# EAGLE design usb_board (EAGLE 9.6.2)
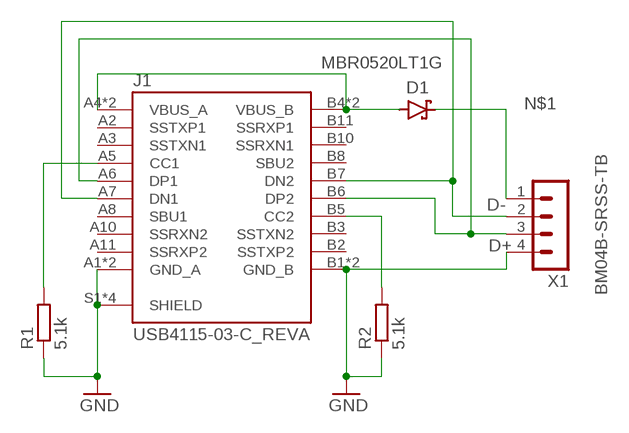
[diagram p0: schematic, sheet 1]

## Parts
D1  MBR0520LT1G  SCHOTTKY_MBR0520LT1GDO-219  [SODFL3718X115]
J1  USB4115-03-C_REVA  [GCT_USB4115-03-C_REVA]
R1  5.1k  R-EU_R0805  [R0805]
R2  5.1k  R-EU_R0805  [R0805]
X1  BM04B-SRSS-TB  [BM04B-SRSS-TB]

## Nets
D+: J1.A6(DP1) J1.B6(DP2) X1.3
D-: J1.A7(DN1) J1.B7(DN2) X1.2
GND: J1.A1(GND_A) J1.A12(GND_A) J1.B1(GND_B) J1.B12(GND_B) J1.S1(SHIELD) J1.S2(SHIELD) J1.S3(SHIELD) J1.S4(SHIELD) R1.1 R2.1 X1.4
N$1: D1.1(C) X1.1
N$2: J1.A5(CC1) R1.2
N$4: J1.B5(CC2) R2.2
VCC: D1.2(A) J1.A4(VBUS_A) J1.A9(VBUS_A) J1.B4(VBUS_B) J1.B9(VBUS_B)
Unconnected: J1.A2(SSTXP1) J1.A3(SSTXN1) J1.A8(SBU1) J1.A10(SSRXN2) J1.A11(SSRXP2) J1.B2(SSTXP2) J1.B3(SSTXN2) J1.B8(SBU2) J1.B10(SSRXN1) J1.B11(SSRXP1)

## Library data of the parts
D1 = Diode:SCHOTTKY_: Schottky Diode - Popular parts; BUY: https://www.digikey.co.uk/en/products/detail/comchip-technology/CDBW140-G/3308555; CATEGORY: Diode; DESCRIPTION: DIODE SCHOTTKY 20V 500MA SOD123; MANUFACTURER: ON Semiconductor; MPN: MBR0520LT1G; SUB-CATEGORY: Schottky
J1 = USB4115-03-C_REVA:USB4115-03-C_REVA: Check prices <https://pricing.snapeda.com/parts/USB4115-03-C/Global%20Connector%20Technology/view-part?ref=eda>; AVAILABILITY: In Stock; DESCRIPTION: USB 3.1 Connector Type C Vertical Receptacle, 9.25mm profile, 24 Pins, Surface mount, Top mount, low cost; MF: Global Connector Technology; MP: USB4115-03-C; PACKAGE: None; PRICE: None
R1 R2 = rcl:R-EU_: RESISTOR, European symbol; SPICEPREFIX: R
X1 = con-JST SH:BM04B-SRSS: JST SH series header 1.00mm pitch disconnectable crimp style connectors, vertical (side entry type), 4 pins

## Board
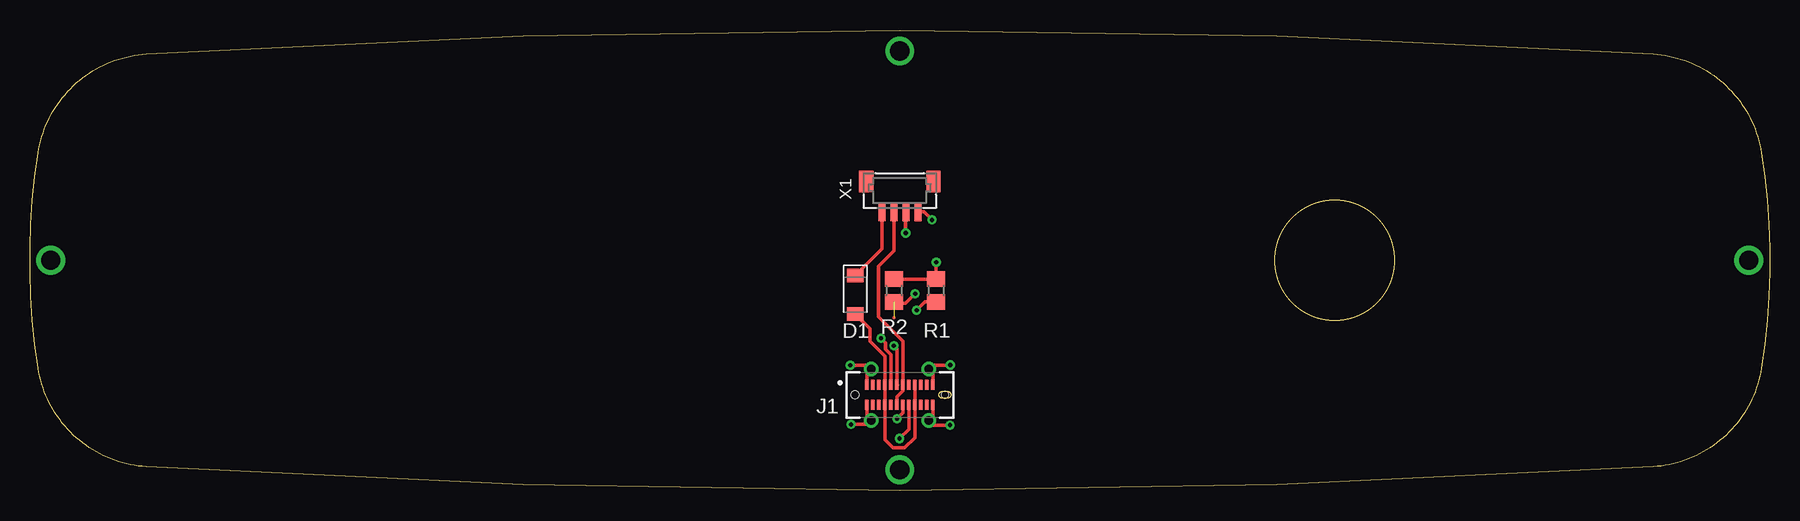
[diagram p1: board, top side]
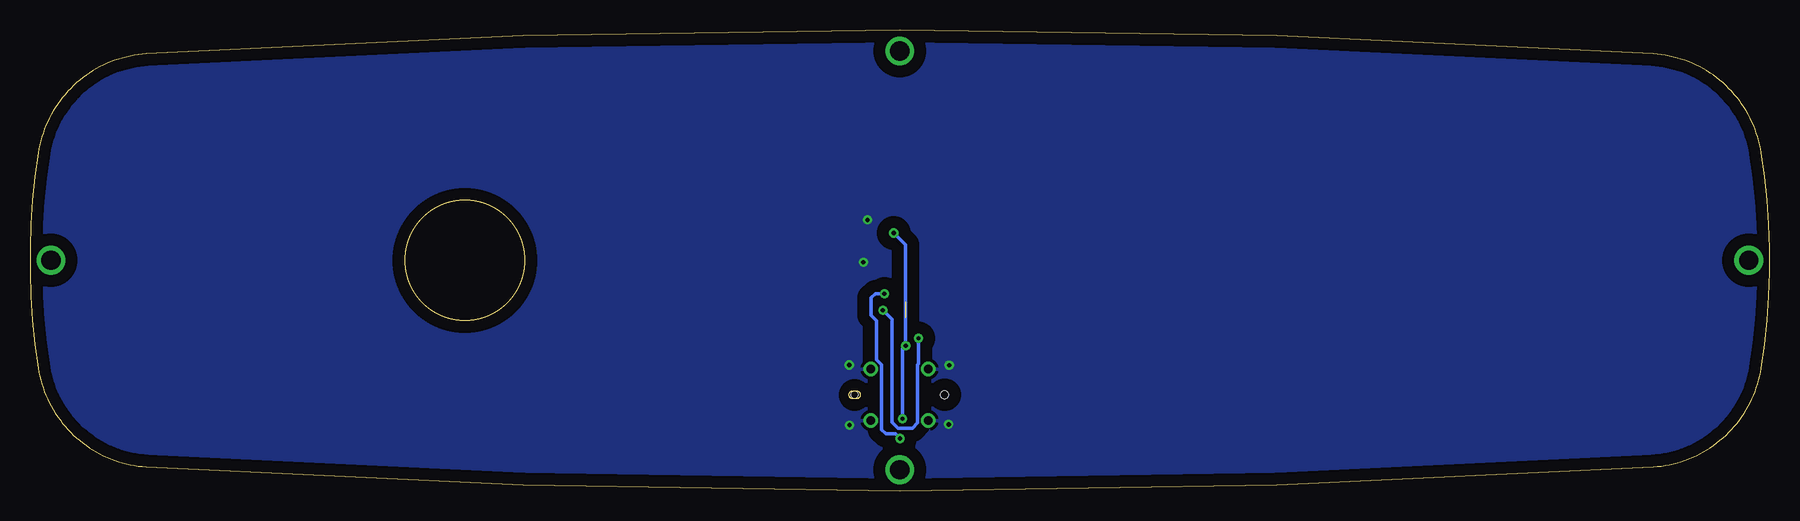
[diagram p2: board, bottom side, seen from below]

Size 145 x 38.4 mm. Coordinates in mm from the lower left corner, seen from the top.
Outline: 135.3,36.4 135.64,36.37 135.97,36.34 136.31,36.28 136.64,36.22 136.97,36.15 137.3,36.06 137.62,35.97 137.94,35.86 138.26,35.74 138.57,35.61 138.88,35.47 139.18,35.32 139.48,35.16 139.77,34.99 140.06,34.81 140.33,34.62 140.61,34.41 140.87,34.2 141.13,33.99 141.38,33.76 141.62,33.52 141.85,33.28 142.08,33.02 142.29,32.76 142.5,32.5 142.7,32.22 142.89,31.94 143.06,31.65 143.23,31.36 143.39,31.06 143.53,30.75 143.67,30.45 143.8,30.13 143.91,29.81 144.01,29.49 144.11,29.17 144.19,28.84 144.26,28.51 144.31,28.17 144.59,26.19 144.8,24.2 144.93,22.2 145,20.2 145,18.2 144.93,16.2 144.8,14.2 144.59,12.21 144.31,10.23 144.26,9.89 144.19,9.56 144.11,9.23 144.01,8.91 143.91,8.59 143.8,8.27 143.67,7.95 143.53,7.64 143.39,7.34 143.23,7.04 143.06,6.75 142.89,6.46 142.7,6.18 142.5,5.9 142.29,5.64 142.08,5.38 141.85,5.12 141.62,4.88 141.38,4.64 141.13,4.41 140.87,4.19 140.61,3.98 140.33,3.78 140.06,3.59 139.77,3.41 139.48,3.24 139.18,3.08 138.88,2.93 138.57,2.79 138.26,2.66 137.94,2.54 137.62,2.43 137.3,2.34 136.97,2.25 136.64,2.18 136.31,2.11 135.97,2.06 135.64,2.02 135.3,2 103.92,0.5 72.5,0 41.08,0.5 9.7,2 9.36,2.02 9.03,2.06 8.69,2.11 8.36,2.18 8.03,2.25 7.7,2.34 7.38,2.43 7.06,2.54 6.74,2.66 6.43,2.79 6.12,2.93 5.82,3.08 5.52,3.24 5.23,3.41 4.95,3.59 4.67,3.78 4.4,3.98 4.13,4.19 3.87,4.41 3.62,4.64 3.38,4.88 3.15,5.12 2.92,5.38 2.71,5.64 2.5,5.9 2.3,6.18 2.12,6.46 1.94,6.75 1.77,7.04 1.61,7.34 1.47,7.64 1.33,7.95 1.2,8.27 1.09,8.59 0.99,8.91 0.89,9.23 0.81,9.56 0.74,9.89 0.69,10.23 0.41,12.21 0.21,14.2 0.07,16.2 0,18.2 0,20.2 0.07,22.2 0.21,24.2 0.41,26.19 0.69,28.17 0.74,28.51 0.81,28.84 0.89,29.17 0.99,29.49 1.09,29.81 1.2,30.13 1.33,30.45 1.47,30.75 1.61,31.06 1.77,31.36 1.94,31.65 2.12,31.94 2.3,32.22 2.5,32.5 2.71,32.76 2.92,33.02 3.15,33.28 3.38,33.52 3.62,33.76 3.87,33.99 4.13,34.2 4.4,34.41 4.67,34.62 4.95,34.81 5.23,34.99 5.52,35.16 5.82,35.32 6.12,35.47 6.43,35.61 6.74,35.74 7.06,35.86 7.38,35.97 7.7,36.06 8.03,36.15 8.36,36.22 8.69,36.28 9.03,36.34 9.36,36.37 9.7,36.4 41.08,37.9 72.5,38.4 103.92,37.9 135.3,36.4
Outline: circle at 108.76,19.2 radius 5
Copper layers (1*16): Top 0.035mm / dielectric 1.5mm / Bottom 0.035mm
Design rules "default *": minimum track width 12mil, minimum drill 0.35mm, track to track 6mil, track to pad 6mil, pad to pad 6mil, via to via 6mil, smd to smd 6mil, copper to edge 40mil, drill to drill 6mil, minimum pad ring 10mil, minimum via ring 8mil, stop-mask expansion 4mil, vias tented up to drill 0mil, thermal gap 10mil

### Footprints (pad centres in the part's own frame; a part is rotated, then mirrored left to right if it is on the bottom)
SODFL3718X115 = smd 1.115 x 1.361: 1 -1.6,0; 2 1.6,0
GCT_USB4115-03-C_REVA = smd 0.3 x 0.85: A1 -2.75,0.835; A2 -2.25,0.835; A3 -1.75,0.835; A4 -1.25,0.835; A5 -0.75,0.835; A6 -0.25,0.835; A7 0.25,0.835; A8 0.75,0.835; A9 1.25,0.835; A10 1.75,0.835; A11 2.25,0.835; A12 2.75,0.835; B1 2.75,-0.835; B2 2.25,-0.835; B3 1.75,-0.835; B4 1.25,-0.835; B5 0.75,-0.835; B6 0.25,-0.835; B7 -0.25,-0.835; B8 -0.75,-0.835; B9 -1.25,-0.835; B10 -1.75,-0.835; B11 -2.25,-0.835; B12 -2.75,-0.835 | drill 0.7 pad 1.1: S1 -2.4,2.15; S2 -2.4,-2.15; S3 2.4,-2.15; S4 2.4,2.15 | hole 0.66: -3.75,0 | hole 0.58: 3.75,0
R0805 = smd 1.3 x 1.5: 1 -0.95,0; 2 0.95,0
BM04B-SRSS-TB = smd 0.6 x 1.55: 1 1.5,0; 2 0.5,0; 3 -0.5,0; 4 -1.5,0 | smd 1.2 x 1.8: M1 2.8,-2.525; M2 -2.8,-2.525

### Placement (x,y rotation side)
D1  68.79,16.33 270 top
J1  72.51,8 0 top
R1  75.52,16.69 270 top
R2  72.02,16.69 270 top
X1  72.51,23.24 180 top

### Tracks (layer width: path | path; a pad name or v marks a point on that pad's centre or on a via)
AGND  (via drill 1.6)
  other vias: 72.5,1.75
D+  (via drill 0.35)
  Top 0.305: 72.31,8.79 J1.A6 72.26,11.82 v72,12.08 | J1.B6 72.76,6.51 v72.26,6.01 | v73,21.48 73,23.23 X1.3
  Bottom 0.305: v72.26,6.01 72.26,11.82 v72,12.08 72,20.49 v73,21.48
D-
  Top 0.305: X1.2 72.01,20.01 70.71,18.71 70.71,14.52 72.76,12.47 J1.A7 72.76,8.33 72.26,7.83 J1.B7
GND  (via drill 0.35)
  Top 0.305: R2.1 R1.1 75.52,19.03 v75.54,19.04 | J1.B1 75.26,6.2 J1.S3 75.28,5.48 v76.68,5.48 | J1.A12 75.26,9.8 J1.S4 75.25,10.48 v76.71,10.48 | J1.A1 69.76,9.8 J1.S1 69.8,10.46 v68.38,10.46 | J1.B12 69.76,6.2 J1.S2 69.8,5.53 v68.43,5.53 | X1.4 74.51,23.24 v75.18,22.57
  pour Bottom (isolate 1): 136.68,44.97 156.98,24.67 156.98,-7.13 152.81,-11.3 1.25,-11.3 -9.3,-0.75 -9.3,36.87 -2.29,43.88
N$1
  Top 0.305: D1.1 71.01,20.16 X1.1
N$2  (via drill 0.35)
  Top 0.305: v70.94,12.72 71.32,12.34 71.32,11.8 71.76,11.36 J1.A5 | v73.91,15.05 74.6,15.74 R1.2
  Bottom 0.305: v70.94,12.72 70.94,10.6 71.02,10.52 71.02,5.65 71.45,5.22 72.64,5.22 73.15,5.73 73.15,14.29 v73.91,15.05
N$3  (via drill 1.6)
  other vias: 1.73,19.2
N$4  (via drill 0.35)  (1 unrouted)
  Top 0.305: R2.2 72.02,15.61 72.97,15.61 v73.79,16.43 | 72.02,14.43 72.01,14.42 | J1.B5 73.26,5.13 v72.49,4.36
  Bottom 0.305: v72.49,4.36 72.87,4.74 73.64,4.74 74,5.1 74,10.52 74.42,10.94 74.42,14.17 74.88,14.62 74.88,16.07 74.52,16.43 v73.79,16.43
N$5  (via drill 1.6)
  other vias: 72.5,36.65
N$6  (via drill 1.6)
  Top 0.305: 143.23,19.2 v143.26,19.2 143.26,19.12
VCC
  Top 0.305: D1.2 70,13.52 70,12.46 71.26,11.2 J1.A4 J1.B9 71.26,4.27 71.96,3.57 72.9,3.57 73.76,4.44 J1.B4 J1.A9